# EAGLE design 100ma (EAGLE 6.6.0)
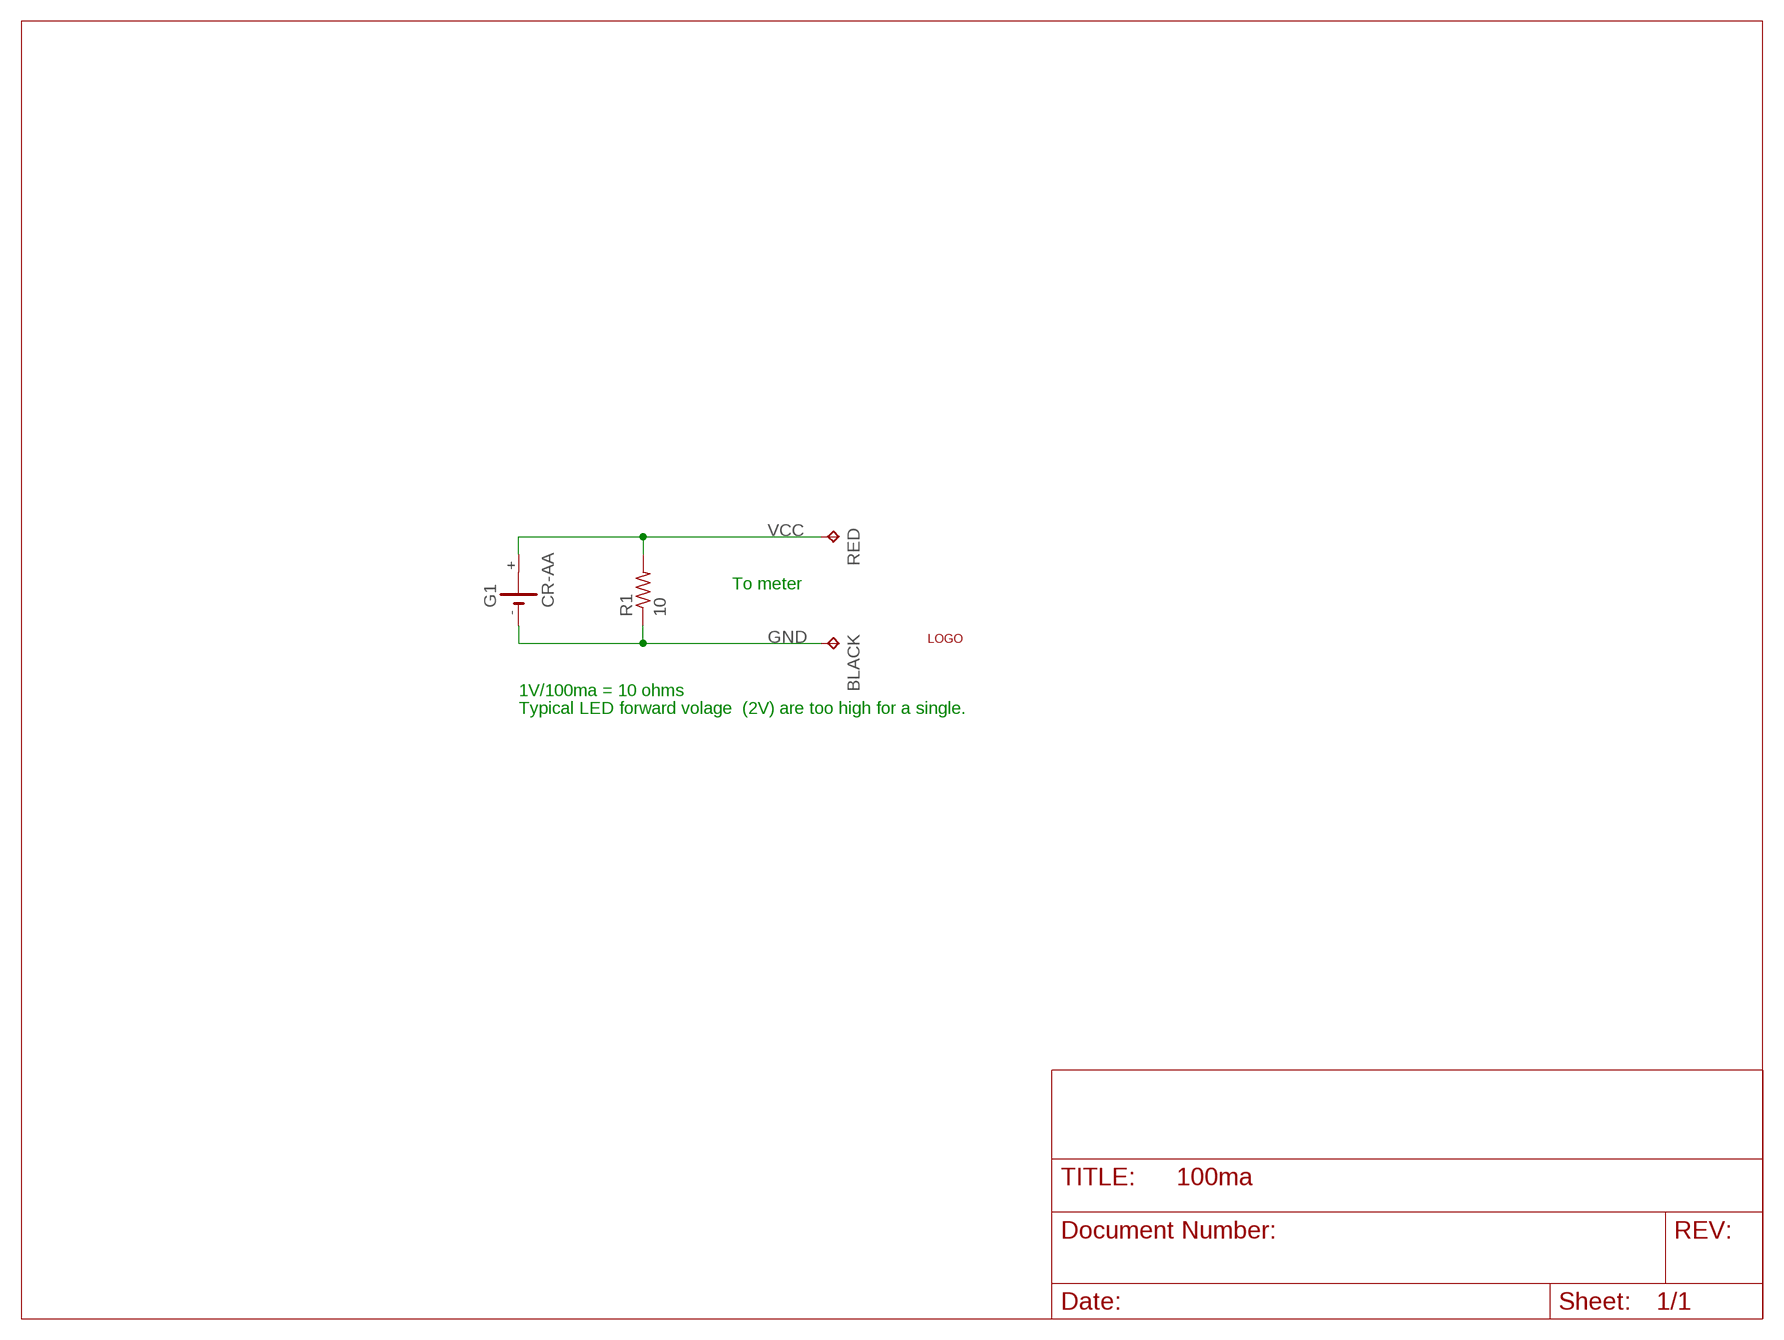
[diagram p0: schematic, sheet 1]

## Parts
BLACK  TPB2,54  [B2,54]
G1  CR-AA  [CRAA]
LOGO  LOGO  [LOGO]
R1  10  R-US_0207/10  [0207/10]
RED  TPB2,54  [B2,54]

## Nets
GND: BLACK.TP G1.- R1.1
VCC: G1.+ R1.2 RED.TP
Unconnected: G1.+@1(+)

## Notes on the sheet
- To meter
- 1V/100ma = 10 ohms
- Typical LED forward volage  (2V) are too high for a single.

## Library data of the parts
BLACK RED = testpad:TP: Test pad
G1 = battery:CR-AA: LI BATTERY Varta CRAA-SLF
LOGO = dec-con:LOGO: Another try at a logo.
R1 = rcl:R-US_: RESISTOR, American symbol

## Board
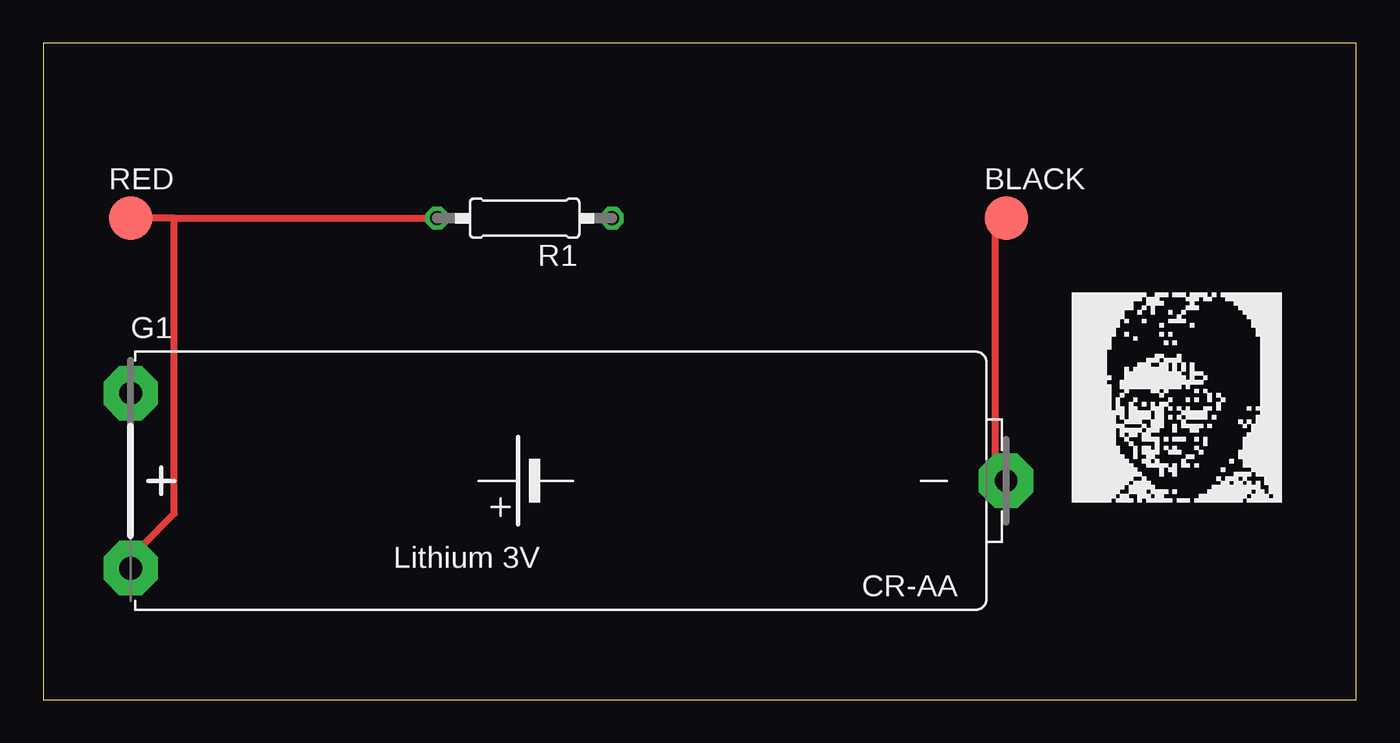
[diagram p1: board, top side]
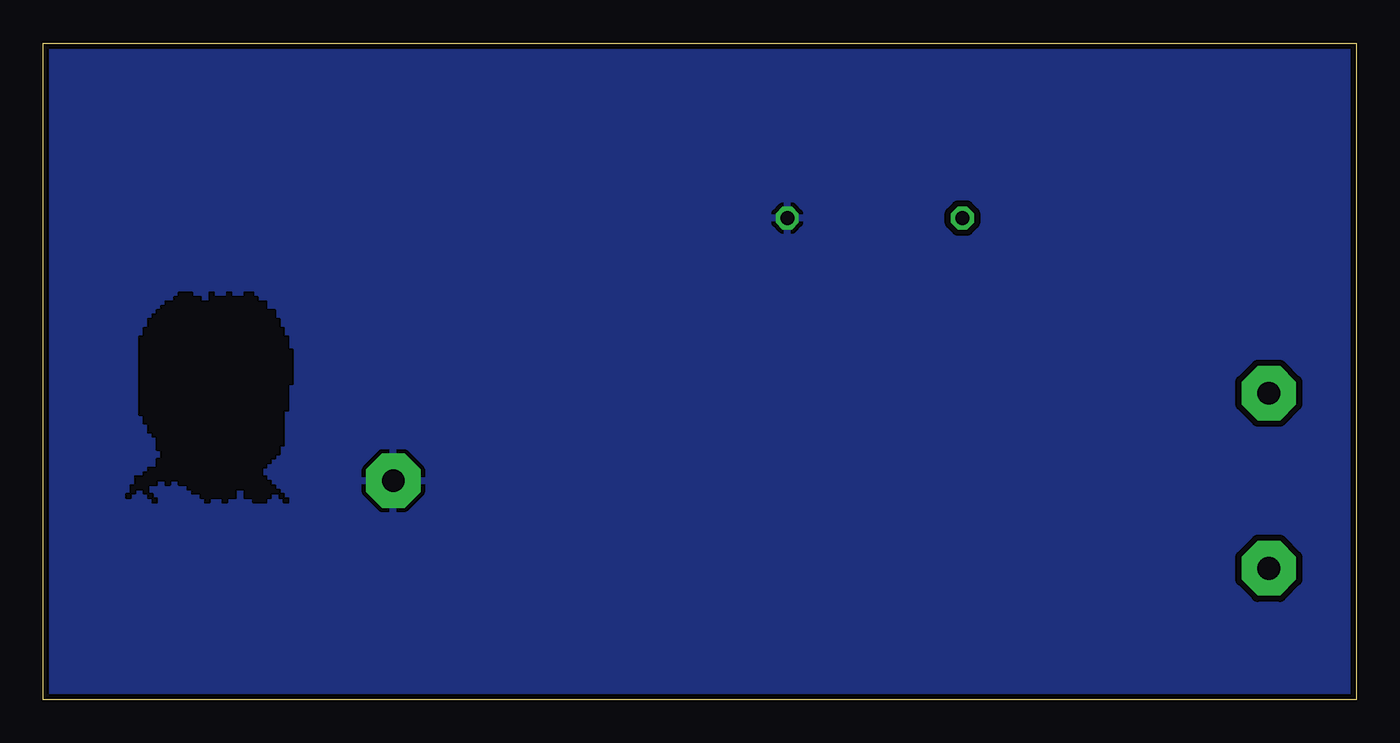
[diagram p2: board, bottom side, seen from below]

Size 76.2 x 38.1 mm. Coordinates in mm from the lower left corner, seen from the top.
Outline: 0,0 76.2,0 76.2,38.1 0,38.1 0,0
Copper layers (1+16): Top 0.035mm / dielectric 1.5mm / Bottom 0.035mm
Design rules "16mils": minimum track width 16mil, minimum drill 32mil, track to track 15mil, track to pad 10mil, pad to pad 10mil, via to via 10mil, smd to smd 10mil, copper to edge 13mil, drill to drill 10mil, minimum pad ring 10mil, minimum via ring 8mil, stop-mask expansion 0mil, vias tented up to drill 0mil, thermal gap 10mil

### Footprints (pad centres in the part's own frame; a part is rotated, then mirrored left to right if it is on the bottom)
B2,54 = smd 2.54 x 2.54: TP 0,0
CRAA = drill 1.321 pad 3.15 octagon: + -25.4,-5.08; +@1 -25.4,5.08; - 25.4,0
0207/10 = drill 0.813 octagon: 1 -5.08,0; 2 5.08,0

### Placement (x,y rotation side)
BLACK  55.88,27.94 0 top
G1  30.48,12.7 0 top
LOGO  59.69,11.43 0 top
R1  27.94,27.94 180 top
RED  5.08,27.94 0 top

### Tracks (layer width: path | path; a pad name or v marks a point on that pad's centre or on a via)
GND
  Top 0.406: BLACK.TP 55.24,27.3 55.24,13.97 G1.-
  pour Bottom: 0,0 76.2,0 76.2,38.1 0,38.1
VCC
  Top 0.406: 7.62,27.94 22.23,27.94 R1.2 | 7.62,27.94 5.71,27.94 RED.TP | 7.62,27.94 7.62,10.79 5.71,8.89 G1.+